# EAGLE design RFID_Brd_00 (EAGLE 7.2.0)
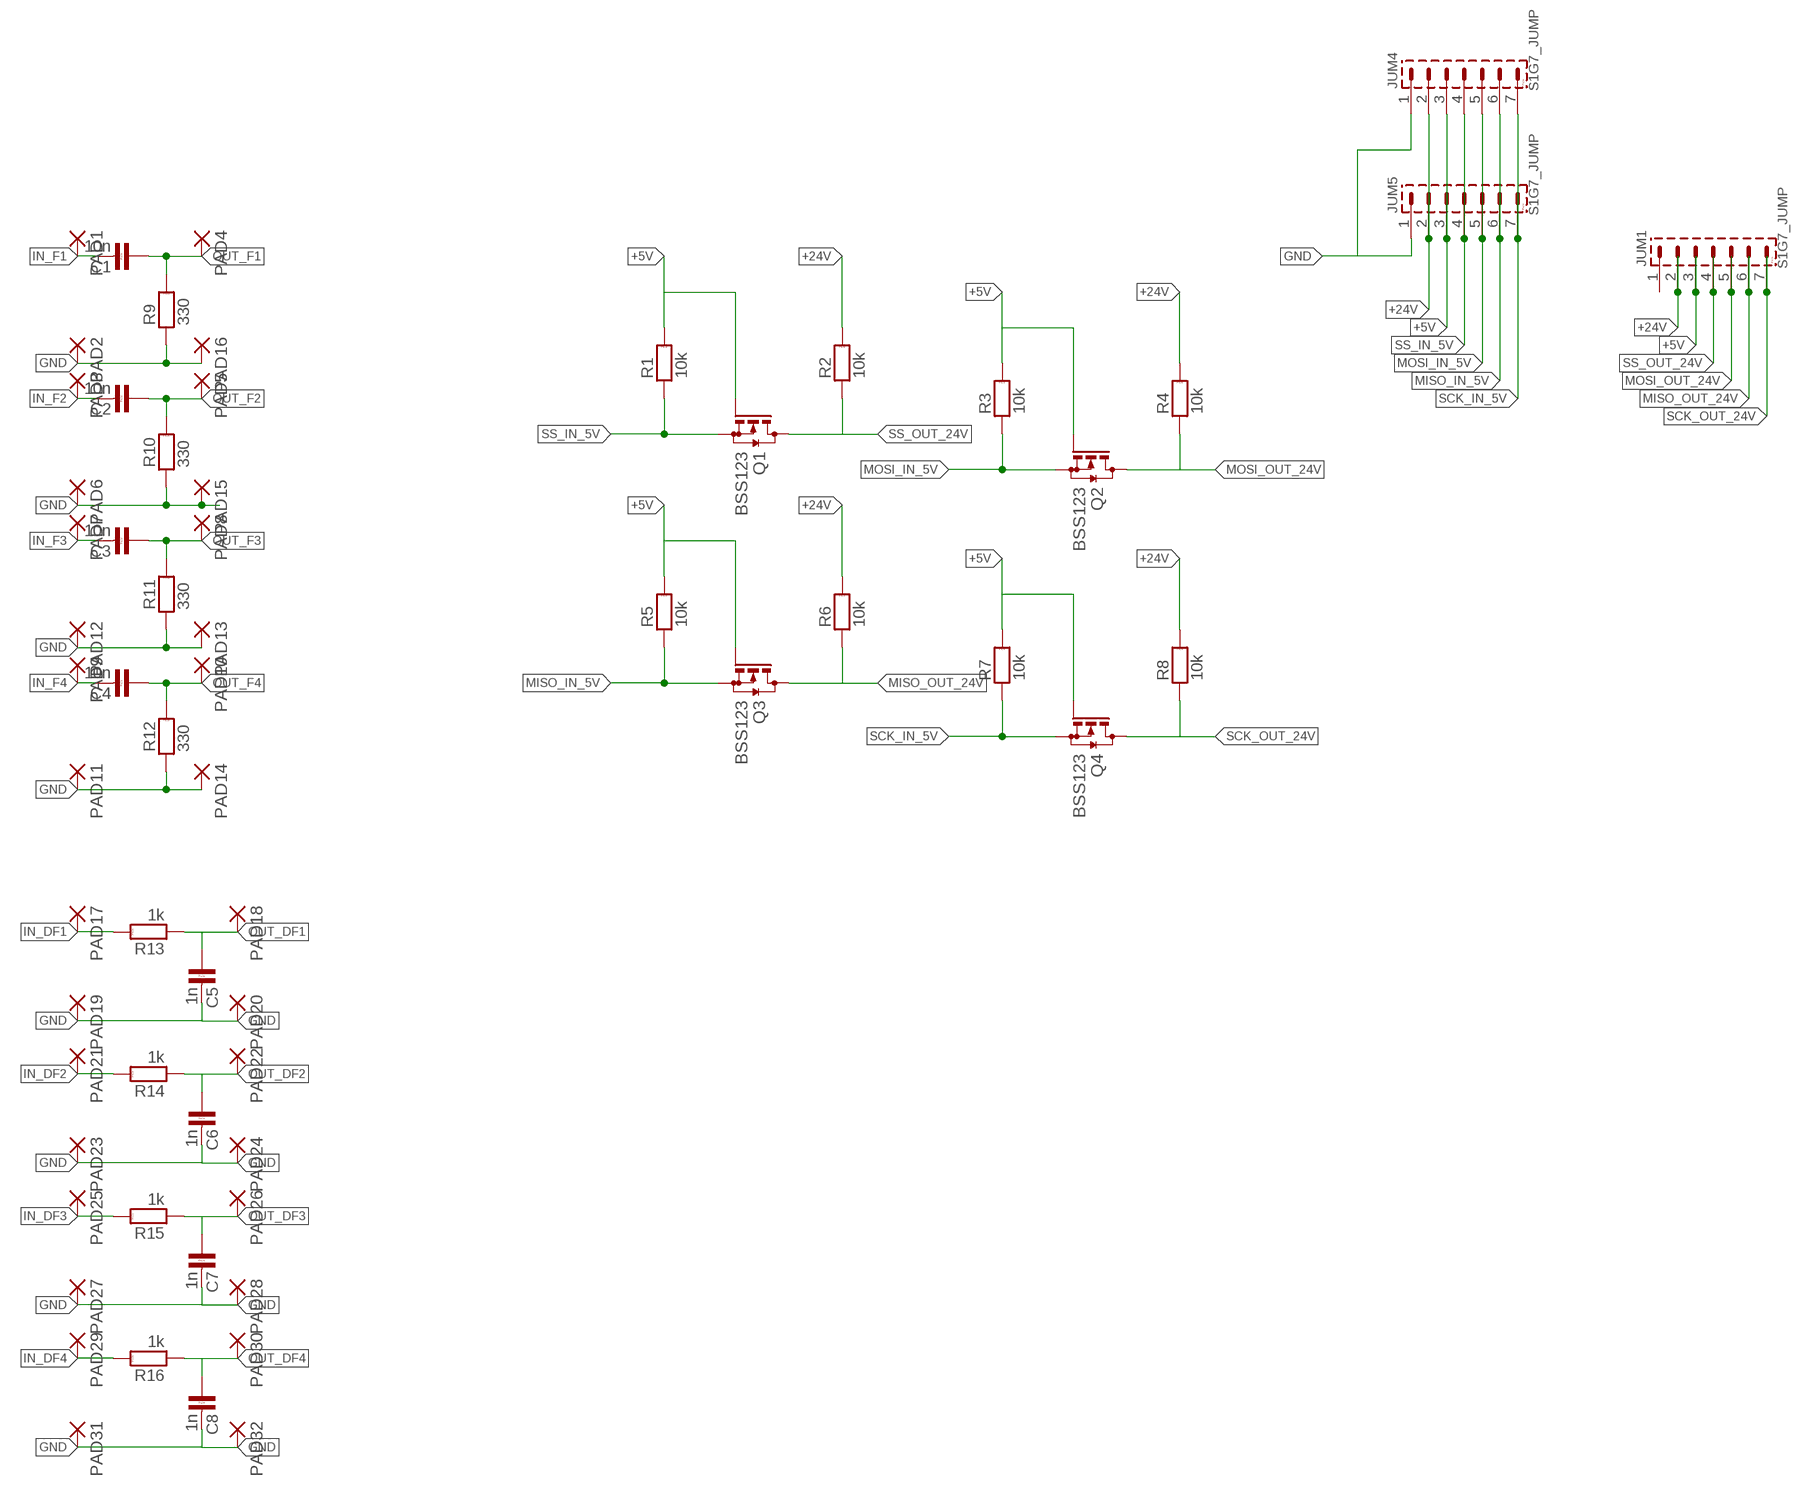
[diagram p0: schematic, sheet 1]

## Parts
C1  10n  C-KER_1206  [1206]
C2  10n  C-KER_1206  [1206]
C3  10n  C-KER_1206  [1206]
C4  10n  C-KER_1206  [1206]
C5  1n  C-KER_1206  [1206]
C6  1n  C-KER_1206  [1206]
C7  1n  C-KER_1206  [1206]
C8  1n  C-KER_1206  [1206]
JUM1  S1G7_JUMP  [S1G7_JUM]
JUM4  S1G7_JUMP  [S1G7_JUM]
JUM5  S1G7_JUMP  [S1G7_JUM]
PAD1  SMD2  [SMD1,27-2,54]
PAD2  SMD2  [SMD1,27-2,54]
PAD3  SMD2  [SMD1,27-2,54]
PAD4  SMD2  [SMD1,27-2,54]
PAD5  SMD2  [SMD1,27-2,54]
PAD6  SMD2  [SMD1,27-2,54]
PAD7  SMD2  [SMD1,27-2,54]
PAD8  SMD2  [SMD1,27-2,54]
PAD9  SMD2  [SMD1,27-2,54]
PAD10  SMD2  [SMD1,27-2,54]
PAD11  SMD2  [SMD1,27-2,54]
PAD12  SMD2  [SMD1,27-2,54]
PAD13  SMD2  [SMD1,27-2,54]
PAD14  SMD2  [SMD1,27-2,54]
PAD15  SMD2  [SMD1,27-2,54]
PAD16  SMD2  [SMD1,27-2,54]
PAD17  SMD2  [SMD1,27-2,54]
PAD18  SMD2  [SMD1,27-2,54]
PAD19  SMD2  [SMD1,27-2,54]
PAD20  SMD2  [SMD1,27-2,54]
PAD21  SMD2  [SMD1,27-2,54]
PAD22  SMD2  [SMD1,27-2,54]
PAD23  SMD2  [SMD1,27-2,54]
PAD24  SMD2  [SMD1,27-2,54]
PAD25  SMD2  [SMD1,27-2,54]
PAD26  SMD2  [SMD1,27-2,54]
PAD27  SMD2  [SMD1,27-2,54]
PAD28  SMD2  [SMD1,27-2,54]
PAD29  SMD2  [SMD1,27-2,54]
PAD30  SMD2  [SMD1,27-2,54]
PAD31  SMD2  [SMD1,27-2,54]
PAD32  SMD2  [SMD1,27-2,54]
Q1  BSS123  [SOT23]
Q2  BSS123  [SOT23]
Q3  BSS123  [SOT23]
Q4  BSS123  [SOT23]
R1  10k  R_1206  [1206]
R2  10k  R_1206  [1206]
R3  10k  R_1206  [1206]
R4  10k  R_1206  [1206]
R5  10k  R_1206  [1206]
R6  10k  R_1206  [1206]
R7  10k  R_1206  [1206]
R8  10k  R_1206  [1206]
R9  330  R_1206  [1206]
R10  330  R_1206  [1206]
R11  330  R_1206  [1206]
R12  330  R_1206  [1206]
R13  1k  R_1206  [1206]
R14  1k  R_1206  [1206]
R15  1k  R_1206  [1206]
R16  1k  R_1206  [1206]

## Nets
+5V: JUM1.3 JUM4.3 JUM5.3 Q1.1(G) Q2.1(G) Q3.1(G) Q4.1(G) R1.2 R3.2 R5.2 R7.2
+24V: JUM1.2 JUM4.2 JUM5.2 R2.2 R4.2 R6.2 R8.2
GND: C5.2 C6.2 C7.2 C8.2 JUM4.1 JUM5.1 PAD2.1(P) PAD6.1(P) PAD11.1(P) PAD12.1(P) PAD13.1(P) PAD14.1(P) PAD15.1(P) PAD16.1(P) PAD19.1(P) PAD20.1(P) PAD23.1(P) PAD24.1(P) PAD27.1(P) PAD28.1(P) PAD31.1(P) PAD32.1(P) R9.1 R10.1 R11.1 R12.1
IN_DF1: PAD17.1(P) R13.2
IN_DF2: PAD21.1(P) R14.2
IN_DF3: PAD25.1(P) R15.2
IN_DF4: PAD29.1(P) R16.2
IN_F1: C1.2 PAD1.1(P)
IN_F2: C2.2 PAD3.1(P)
IN_F3: C3.2 PAD7.1(P)
IN_F4: C4.2 PAD9.1(P)
MISO_IN_5V: JUM4.6 JUM5.6 Q3.2(S) R5.1
MISO_OUT_24V: JUM1.6 Q3.3(D) R6.1
MOSI_IN_5V: JUM4.5 JUM5.5 Q2.2(S) R3.1
MOSI_OUT_24V: JUM1.5 Q2.3(D) R4.1
OUT_DF1: C5.1 PAD18.1(P) R13.1
OUT_DF2: C6.1 PAD22.1(P) R14.1
OUT_DF3: C7.1 PAD26.1(P) R15.1
OUT_DF4: C8.1 PAD30.1(P) R16.1
OUT_F1: C1.1 PAD4.1(P) R9.2
OUT_F2: C2.1 PAD5.1(P) R10.2
OUT_F3: C3.1 PAD8.1(P) R11.2
OUT_F4: C4.1 PAD10.1(P) R12.2
SCK_IN_5V: JUM4.7 JUM5.7 Q4.2(S) R7.1
SCK_OUT_24V: JUM1.7 Q4.3(D) R8.1
SS_IN_5V: JUM4.4 JUM5.4 Q1.2(S) R1.1
SS_OUT_24V: JUM1.4 Q1.3(D) R2.1
Unconnected: JUM1.1

## Library data of the parts
C1-C8 = #PaJa_31:C-KER: Kondenzator - keramicky
JUM1 JUM4 JUM5 = #PaJa_konektory:S1G7_JUMP: Radove konektory - koliky - 7x
PAD1-PAD32 = wirepad:SMD2: SMD PAD
Q1-Q4 = transistor-small-signal:BSS123: N-CHANNEL MOS FET
R1-R16 = #PaJa_31:R: Rezistor

## Board
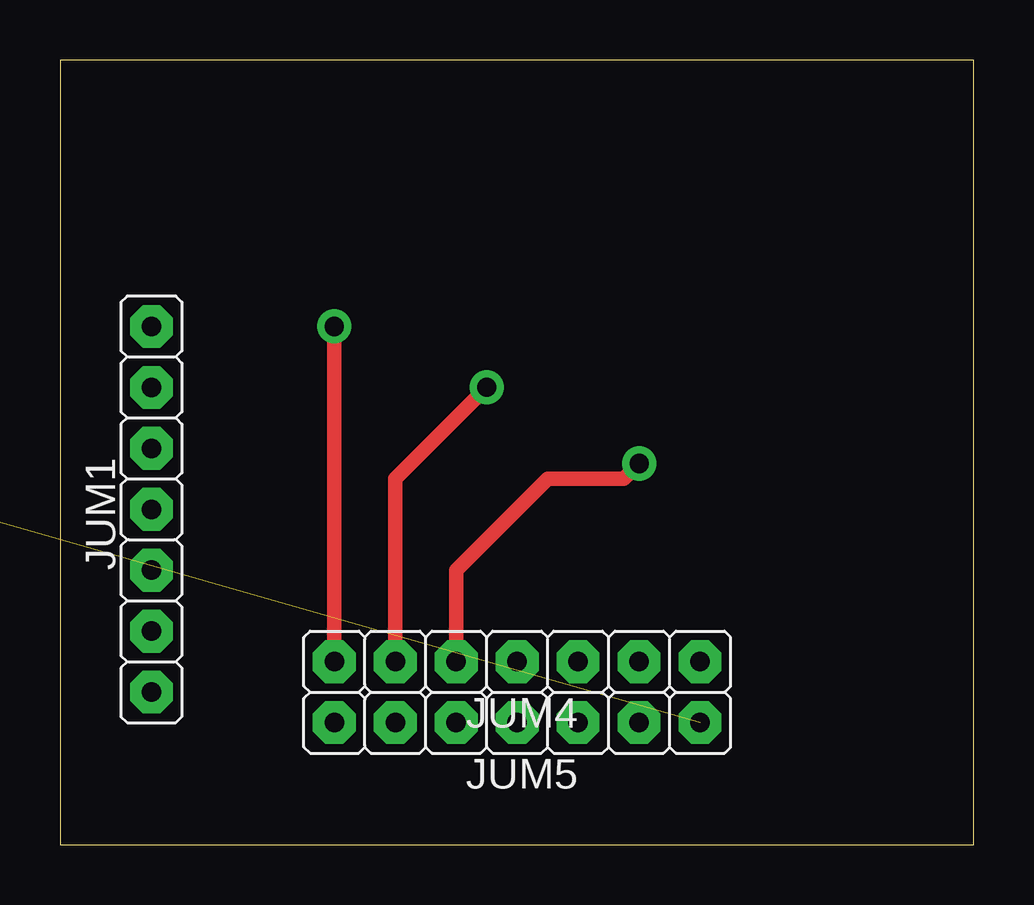
[diagram p1: board, top side]
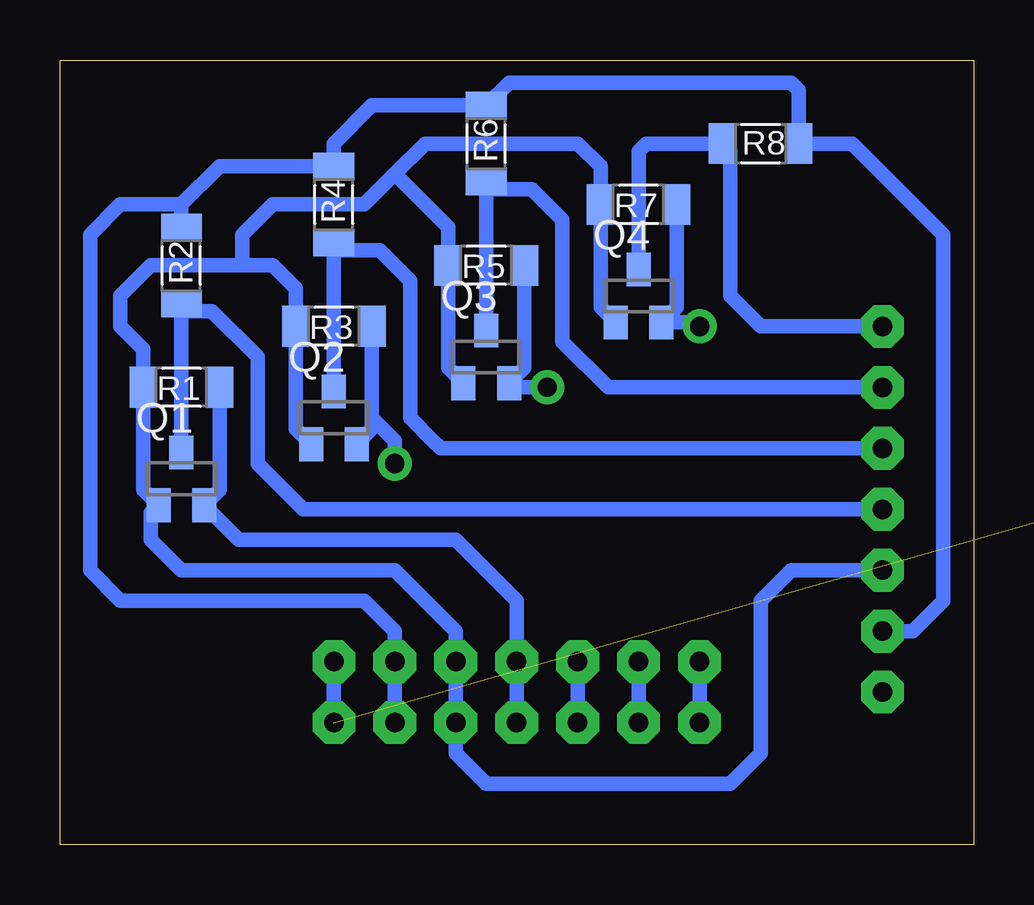
[diagram p2: board, bottom side, seen from below]

Size 38.08 x 32.69 mm. Coordinates in mm from the lower left corner, seen from the top.
Outline: 0,0 38.08,0 38.08,32.69 0,32.69 0,0
Copper layers (1*16): Top 0.035mm / dielectric 1.5mm / Bottom 0.035mm
Design rules "default": minimum track width 10mil, minimum drill 24mil, track to track 8mil, track to pad 8mil, pad to pad 8mil, via to via 8mil, smd to smd 8mil, copper to edge 40mil, drill to drill 8mil, minimum pad ring 10mil, minimum via ring 8mil, stop-mask expansion 4mil, vias tented up to drill 0mil, thermal gap 10mil

### Footprints (pad centres in the part's own frame; a part is rotated, then mirrored left to right if it is on the bottom)
1206 = smd 1.143 x 1.702: 1 -1.587,0; 2 1.587,0
S1G7_JUM = drill 0.813 pad 1.778 octagon: 1 -7.62,0; 2 -5.08,0; 3 -2.54,0; 4 0,0; 5 2.54,0; 6 5.08,0; 7 7.62,0
SMD1,27-2,54 = smd 1.27 x 2.54: 1 0,0
SOT23 = smd 1 x 1.4: 1 -0.95,-1.1; 2 0.95,-1.1; 3 0,1.1

### Placement (x,y rotation side)
C1  -41.91,25.4 0 bottom  (outside the outline)
C2  -41.91,20.32 0 bottom  (outside the outline)
C3  -41.91,15.24 0 bottom  (outside the outline)
C4  -41.91,10.16 0 bottom  (outside the outline)
C5  -38.1,-1.27 270 bottom  (outside the outline)
C6  -38.1,-6.35 270 bottom  (outside the outline)
C7  -38.1,-11.43 270 bottom  (outside the outline)
C8  -38.1,-16.51 270 bottom  (outside the outline)
JUM1  3.81,13.97 90 top
JUM4  19.05,7.62 180 top
JUM5  19.05,5.08 180 top
PAD1  -45.72,25.4 90 bottom  (outside the outline)
PAD2  -35.56,12.7 270 bottom  (outside the outline)
PAD3  -45.72,20.32 270 bottom  (outside the outline)
PAD4  -35.56,25.4 90 bottom  (outside the outline)
PAD5  -35.56,20.32 270 bottom  (outside the outline)
PAD6  -35.56,22.86 270 bottom  (outside the outline)
PAD7  -45.72,15.24 270 bottom  (outside the outline)
PAD8  -35.56,15.24 270 bottom  (outside the outline)
PAD9  -45.72,10.16 270 bottom  (outside the outline)
PAD10  -35.56,10.16 270 bottom  (outside the outline)
PAD11  -35.56,17.78 270 bottom  (outside the outline)
PAD12  -45.72,12.7 270 bottom  (outside the outline)
PAD13  -45.72,7.62 270 bottom  (outside the outline)
PAD14  -35.56,7.62 270 bottom  (outside the outline)
PAD15  -45.72,17.78 270 bottom  (outside the outline)
PAD16  -45.72,22.86 270 bottom  (outside the outline)
PAD17  -45.72,0 270 bottom  (outside the outline)
PAD18  -35.56,0 270 bottom  (outside the outline)
PAD19  -35.56,-2.54 270 bottom  (outside the outline)
PAD20  -45.72,-2.54 270 bottom  (outside the outline)
PAD21  -45.72,-5.08 270 bottom  (outside the outline)
PAD22  -35.56,-5.08 270 bottom  (outside the outline)
PAD23  -35.56,-7.62 270 bottom  (outside the outline)
PAD24  -45.72,-7.62 270 bottom  (outside the outline)
PAD25  -45.72,-10.16 270 bottom  (outside the outline)
PAD26  -35.56,-10.16 270 bottom  (outside the outline)
PAD27  -35.56,-12.7 270 bottom  (outside the outline)
PAD28  -45.72,-12.7 270 bottom  (outside the outline)
PAD29  -45.72,-15.24 270 bottom  (outside the outline)
PAD30  -35.56,-15.24 270 bottom  (outside the outline)
PAD31  -45.72,-17.78 270 bottom  (outside the outline)
PAD32  -35.56,-17.78 90 bottom  (outside the outline)
Q1  33.02,15.24 0 bottom
Q2  26.67,17.78 0 bottom
Q3  20.32,20.32 0 bottom
Q4  13.97,22.86 0 bottom
R1  33.02,19.05 180 bottom
R2  33.02,24.13 90 bottom
R3  26.67,21.59 180 bottom
R4  26.67,26.67 90 bottom
R5  20.32,24.13 180 bottom
R6  20.32,29.21 90 bottom
R7  13.97,26.67 180 bottom
R8  8.89,29.21 0 bottom
R9  -38.1,24.13 90 bottom  (outside the outline)
R10  -38.1,19.05 90 bottom  (outside the outline)
R11  -38.1,13.97 90 bottom  (outside the outline)
R12  -38.1,8.89 90 bottom  (outside the outline)
R13  -41.91,0 0 bottom  (outside the outline)
R14  -41.91,-5.08 0 bottom  (outside the outline)
R15  -41.91,-10.16 0 bottom  (outside the outline)
R16  -41.91,-15.24 0 bottom  (outside the outline)

### Tracks (layer width: path | path; a pad name or v marks a point on that pad's centre or on a via)
+5V
  Bottom 0.61: Q4.1 15.56,22.4 R7.2 15.56,28.26 16.51,29.21 22.86,29.21 24.13,27.94 | Q3.1 21.91,19.86 R5.2 21.91,25.72 24.13,27.94 | Q2.1 28.26,17.32 R3.2 28.26,23.18 29.21,24.13 30.48,24.13 | 30.48,24.13 30.48,25.4 29.21,26.67 25.4,26.67 24.13,27.94 | 30.48,24.13 34.29,24.13 35.56,22.86 35.56,21.59 34.61,20.64 R1.2 34.61,14.78 Q1.1 34.29,13.82 34.29,12.7 33.02,11.43 24.13,11.43 21.59,8.89 JUM4.3 JUM5.3 21.59,3.81 20.32,2.54 10.16,2.54 8.89,3.81 8.89,10.16 7.62,11.43 JUM1.3
+24V
  Bottom 0.61: 33.02,26.67 31.43,28.26 R4.2 26.67,29.21 25.08,30.8 R6.2 19.37,31.75 7.62,31.75 7.3,31.43 R8.2 5.08,29.21 1.27,25.4 1.27,10.16 2.54,8.89 JUM1.2 | 33.02,26.67 R2.2 | 33.02,26.67 35.56,26.67 36.83,25.4 36.83,11.43 35.56,10.16 25.4,10.16 24.13,8.89 JUM4.2 JUM5.2
GND  (24 unrouted)
  Bottom 0.61: JUM4.1 JUM5.1
IN_DF1  (1 unrouted)
IN_DF2  (1 unrouted)
IN_DF3  (1 unrouted)
IN_DF4  (1 unrouted)
IN_F1  (1 unrouted)
IN_F2  (1 unrouted)
IN_F3  (1 unrouted)
IN_F4  (1 unrouted)
MISO_IN_5V  (via drill 0.8 pad 1.42)
  Top 0.61: JUM4.6 13.97,15.24 v17.78,19.05
  Bottom 0.61: R5.1 18.73,19.86 Q3.2 19.2,19.05 v17.78,19.05 | JUM5.6 JUM4.6
MISO_OUT_24V
  Bottom 0.61: Q3.3 R6.1 20,27.3 18.41,27.3 17.14,26.04 17.14,20.95 15.24,19.05 JUM1.6
MOSI_IN_5V  (via drill 0.8 pad 1.42)
  Top 0.61: v24.13,15.88 23.5,15.24 20.32,15.24 16.51,11.43 JUM4.5
  Bottom 0.61: R3.1 25.08,17.78 | 25.08,17.78 25.08,17.32 Q2.2 | v24.13,15.88 24.13,16.83 25.08,17.78 | JUM5.5 JUM4.5
MOSI_OUT_24V
  Bottom 0.61: Q2.3 R4.1 26.35,24.77 24.77,24.77 23.5,23.5 23.5,17.78 22.54,16.83 22.23,16.51 JUM1.5
OUT_DF1  (2 unrouted)
OUT_DF2  (2 unrouted)
OUT_DF3  (2 unrouted)
OUT_DF4  (2 unrouted)
OUT_F1  (2 unrouted)
OUT_F2  (2 unrouted)
OUT_F3  (2 unrouted)
OUT_F4  (2 unrouted)
SCK_IN_5V  (via drill 0.8 pad 1.42)
  Top 0.61: v11.43,21.59 JUM4.7
  Bottom 0.61: R7.1 12.38,22.4 Q4.2 11.6,21.76 v11.43,21.59 | JUM5.7 JUM4.7
SCK_OUT_24V
  Bottom 0.61: Q4.3 13.97,28.89 13.65,29.21 R8.1 10.16,28.89 10.16,22.86 8.89,21.59 JUM1.7
SS_IN_5V
  Bottom 0.61: R1.1 31.43,14.78 Q1.2 30.63,12.7 21.59,12.7 19.05,10.16 JUM4.4 JUM5.4
SS_OUT_24V
  Bottom 0.61: Q1.3 R2.1 32.7,22.23 31.75,22.23 29.84,20.32 29.84,15.88 27.94,13.97 JUM1.4